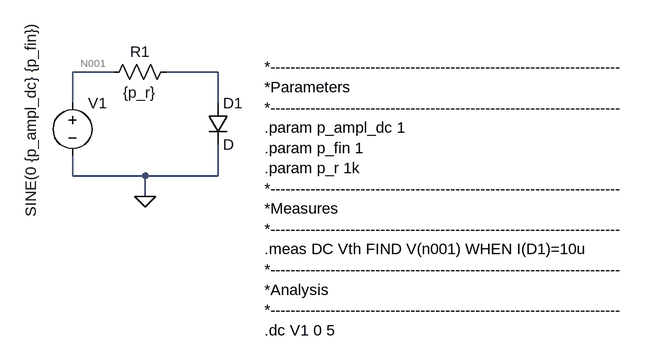
[diagram p0: schematic DIODE_DC.asc]
DIODE_DC.asc, the LTspice schematic file:
Version 4
SHEET 1 1140 680
WIRE 176 32 112 32
WIRE 336 32 256 32
WIRE 112 80 112 32
WIRE 336 80 336 32
WIRE 112 192 112 160
WIRE 224 192 112 192
WIRE 336 192 336 144
WIRE 336 192 224 192
WIRE 224 224 224 192
FLAG 224 224 0
SYMBOL voltage 112 64 R0
WINDOW 3 -64 -111 VRight 2
WINDOW 123 0 0 Left 0
WINDOW 39 0 0 Left 0
SYMATTR InstName V1
SYMATTR Value SINE(0 {p_ampl_dc} {p_fin})
SYMBOL res 272 16 R90
WINDOW 0 0 56 VBottom 2
WINDOW 3 32 56 VTop 2
SYMATTR InstName R1
SYMATTR Value {p_r}
SYMBOL diode 320 80 R0
SYMATTR InstName D1
TEXT 408 24 Left 2 !*----------------------------------------------------------------------\n*Parameters\n*----------------------------------------------------------------------\n.param p_ampl_dc 1\n.param p_fin 1\n.param p_r 1k \n*----------------------------------------------------------------------\n*Measures\n*----------------------------------------------------------------------\n.meas DC Vth FIND V(n001) WHEN I(D1)=10u\n*----------------------------------------------------------------------\n*Analysis\n*----------------------------------------------------------------------\n.dc V1 0 5

The netlist it stands for:
* DIODE_DC.asc
V1 N001 0 SINE(0 {p_ampl_dc} {p_fin})
R1 N002 N001 {p_r}
D1 N002 0 D
.model D D
.lib standard.dio
*----------------------------------------------------------------------
*Parameters
*----------------------------------------------------------------------
.param p_ampl_dc 1
.param p_fin 1
.param p_r 1k
*----------------------------------------------------------------------
*Measures
*----------------------------------------------------------------------
.meas DC Vth FIND V(n001) WHEN I(D1)=10u
*----------------------------------------------------------------------
*Analysis
*----------------------------------------------------------------------
.dc V1 0 5
.backanno
.end